# Altium schematic sheet MINI_ESC_V1.0.SchDoc: MINI有刷电调-G0
size A4; DocumentNumber: 01; Revision: V1.0; SheetNumber: 1; SheetTotal: 1
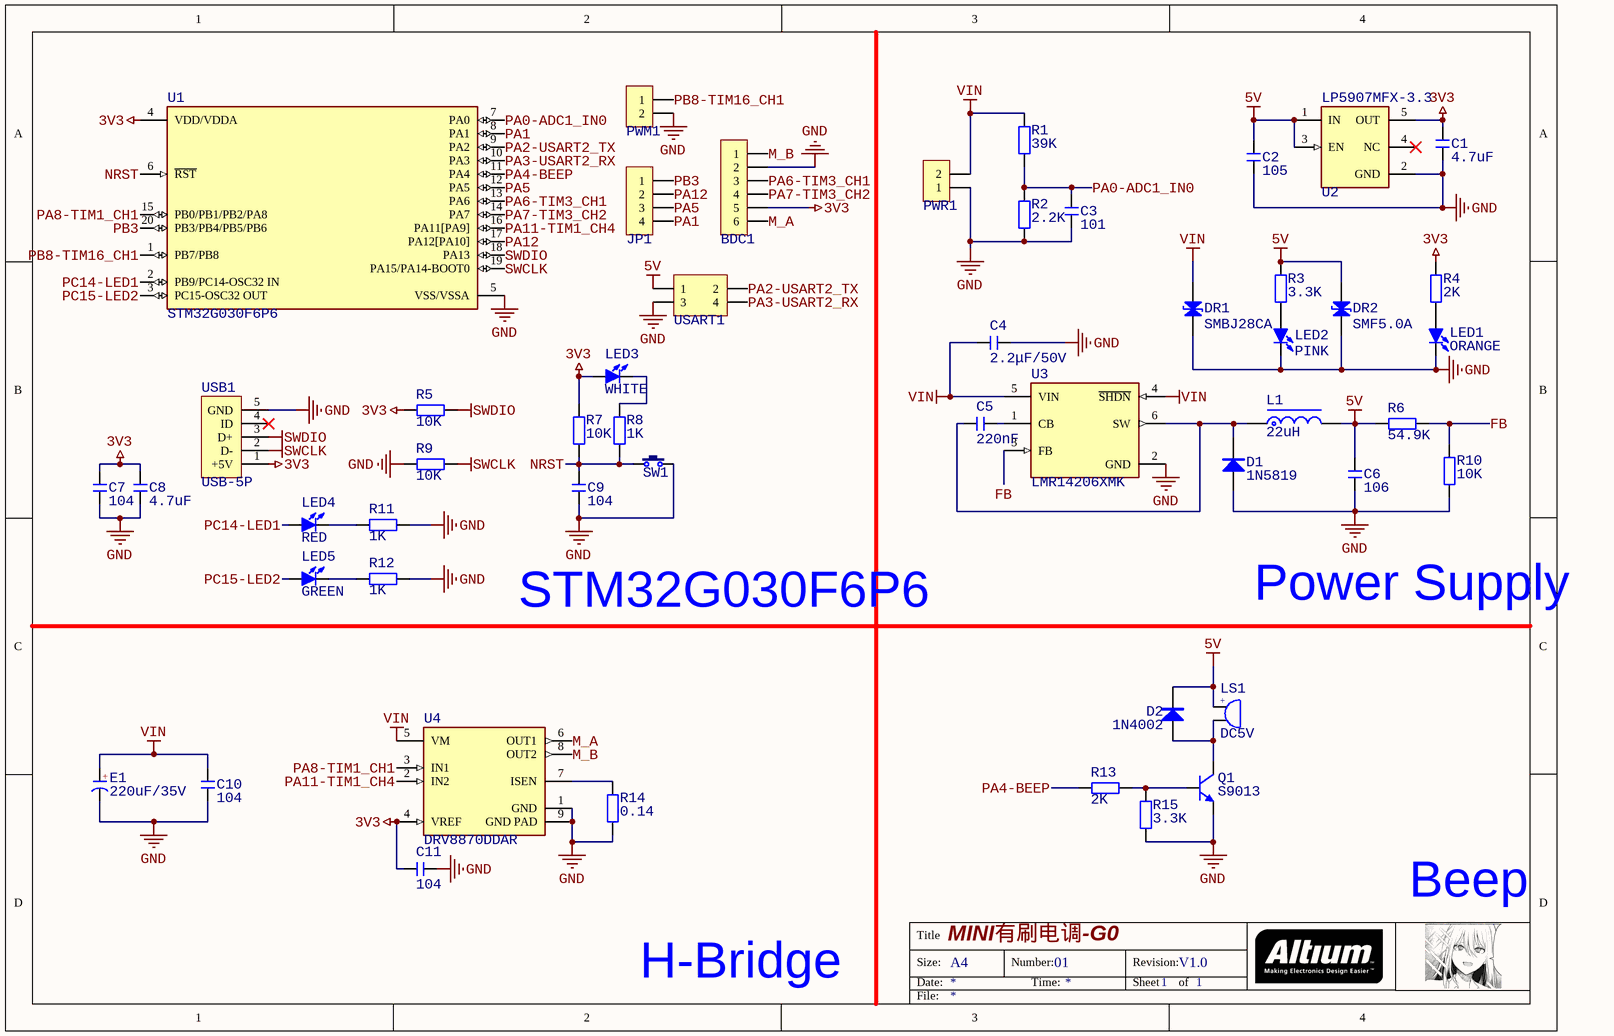
[diagram p0: MINI_ESC_V1.0.SchDoc]

## Parts
BDC1  HDR-1X6  [XH2.54-LS-6P]  (value not drawn)
C1  4.7uF  [C 0603_L]
C2  105  [C 0603_L]
C3  101  [C 0603_L]
C4  2.2μF/50V  [C 0603_L]
C5  220nF  [C 0603_L]
C6  106  [C 0603_L]
C7  104  [C 0402_L]
C8  4.7uF  [C 0402_L]
C9  104  [C 0603_L]
C10  104  [C 0402_L]
C11  104  [C 0402_L]
D1  1N5819  [SOD-123]
D2  1N4002  [SOD-123]
DR1  SMBJ28CA  [SMB]
DR2  SMF5.0A  [SOD-323]
E1  220uF/35V  [CAP 3.5*8*11.5-H - BK]
JP1  HDR-1X4  [HDR2.54-LI-4P]  (value not drawn)
L1  22uH  [NR4030]
LED1  ORANGE  [LED 0603R]
LED2  PINK  [LED 0603R]
LED3  WHITE  [LED 0603W]
LED4  RED  [LED 0603R]
LED5  GREEN  [LED 0603G]
LS1  DC5V  [BEEP 6.5x12x6]
PWM1  HDR-1X2  [GH1.25-LS-2P]  (value not drawn)
PWR1  绿头卧式2P  [15EDGVM-02P-3.81mm]  (value not drawn)
Q1  S9013  [SOT23-3L]
R1  39K  [R 0603_L]
R2  2.2K  [R 0603_L]
R3  3.3K  [R 0603_L]
R4  2K  [R 0603_L]
R5  10K  [R 0603_L]
R6  54.9K  [R 0603_L]
R7  10K  [R 0603_L]
R8  1K  [R 0603_L]
R9  10K  [R 0603_L]
R10  10K  [R 0603_L]
R11  1K  [R 0402_L]
R12  1K  [R 0402_L]
R13  2K  [R 0603_L]
R14  0.14  [R 1206_L]
R15  3.3K  [R 0603_L]
SW1  6x6x5  [TS 2PIN 6x6x4.8]  (value not drawn)
U1  STM32G030F6P6  [STMicroelectronics_TSSOP20-YA_IPC_C]
U2  LP5907MFX-3.3  [Diodes_SOT25_MFG]
U3  LMR14206XMK  [Texas_Instruments_DDC0006A_0]
U4  DRV8870DDAR  [Texas_Instruments_DDA0008J_IPC_C]
USART1  Header2X2  [HDR2.54-M-LS-2x2P]  (value not drawn)
USB1  USB-5P  [USB-MICRO_E]

## Nets
3V3: BDC1.5 C1.2 C7.2 C8.2 C11.2 LED3.1(A) R4.2 R5.2 R7.2 U1.4(VDD/VDDA) U2.5(OUT) U4.4(VREF) USB1.1(+5V)
5V: C2.2 C6.1 D2.2(K) DR2.2(K) L1.2 LS1.1 R3.2 R6.1 U2.1(IN) U2.3(EN) USART1.1
GND: BDC1.2 C1.1 C2.1 C3.1 C4.2 C6.2 C7.1 C8.1 C9.1 C10.1 C11.1 D1.1(A) DR1.2(K) DR2.1(A) E1.2(K) LED1.2(K) LED2.2(K) PWM1.2 PWR1.1 Q1.2(E) R2.1 R9.2 R10.2 R11.1 R12.1 R14.1 R15.1 SW1.2 U1.5(VSS/VSSA) U2.2(GND) U3.2(GND) U4.1(GND) U4.9(GND_PAD) USART1.3 USB1.5(GND)
SWCLK: R9.1 U1.19(PA15/PA14-BOOT0) USB1.2(D-)
SWDIO: R5.1 U1.18(PA13) USB1.3(D+)
VIN: C4.1 C10.2 DR1.1(A) E1.1(A) PWR1.2 R1.2 U3.4(~{SHDN}) U3.5(VIN) U4.5(VM)
FB: R6.2 R10.1 U3.3(FB)
M_A: BDC1.6 U4.6(OUT1)
M_B: BDC1.1 U4.8(OUT2)
NRST: C9.2 R7.1 R8.1 SW1.1 U1.6(~{RST})
PA0-ADC1_IN0: C3.2 R1.1 R2.2 U1.7(PA0)
PA1: JP1.4 U1.8(PA1)
PA2-USART2_TX: U1.9(PA2) USART1.2
PA3-USART2_RX: U1.10(PA3) USART1.4
PA4-BEEP: R13.1 U1.11(PA4)
PA5: JP1.3 U1.12(PA5)
PA6-TIM3_CH1: BDC1.3 U1.13(PA6)
PA7-TIM3_CH2: BDC1.4 U1.14(PA7)
PA8-TIM1_CH1: U1.15(PB0/PB1/PB2/PA8) U4.3(IN1)
PA11-TIM1_CH4: U1.16(PA11[PA9]) U4.2(IN2)
PA12: JP1.2 U1.17(PA12[PA10])
PB3: JP1.1 U1.20(PB3/PB4/PB5/PB6)
PB8-TIM16_CH1: PWM1.1 U1.1(PB7/PB8)
PC14-LED1: LED4.1(A) U1.2(PB9/PC14-OSC32_IN)
PC15-LED2: LED5.1(A) U1.3(PC15-OSC32_OUT)
NetC5_1: C5.1 U3.1(CB)
NetC5_2: C5.2 D1.2(K) L1.1 U3.6(SW)
NetD2_1: D2.1(A) LS1.2 Q1.3(C)
NetLED1_1: LED1.1(A) R4.1
NetLED2_1: LED2.1(A) R3.1
NetLED3_2: LED3.2(K) R8.2
NetLED4_2: LED4.2(K) R11.2
NetLED5_2: LED5.2(K) R12.2
NetQ1_1: Q1.1(B) R13.2 R15.2
NetR14_2: R14.2 U4.7(ISEN)

Not connected (* = marked no-connect by the designer): U2 4(NC)*; USB1 4(ID)*

## Notes on the sheet
- STM32G030F6P6
- Power Supply
- Beep
- H-Bridge
- Title
- Size:
- Date:
- A4
- Number:
- Time:
- Revision:
- Sheet
- of
- File:
- (in symbol BEEP) +
- (in symbol C-CAP) +

## Library data of the parts
BDC1 = Header 6: 6P接插件; BOM名称: 6P接插件
C1-C11 = C: 无极性贴片电容; 材质: X7R; BOM名称: 无极性贴片电容
D1 = 1N5819: 肖特基二极管; 属性: 40V/2A; BOM名称: 肖特基二极管
D2 = 1N4007: 整流二极管; BOM名称: 整流二极管
DR1 DR2 = DR: 瞬态电压抑制二极管; BOM名称: 瞬态电压抑制二极管
E1 = C-CAP: 直插电解电容; BOM名称: 直插电解电容
JP1 = Header 4: 4P接插件; BOM名称: 4P接插件
L1 = L-NR: NR磁胶电感; BOM名称: NR磁胶电感
LED1-LED5 = LED-SMD: 贴片LED; BOM名称: 贴片LED
LS1 = BEEP: 蜂鸣器; BOM名称: 蜂鸣器
PWM1 = Header 2: 2P接插件; BOM名称: 2P接插件
PWR1 = 绿头卧式2P: 3.81间距
Q1 = 9013-SMD: 低频放大-NPN型; 属性: 50V?0.5A?0.625W; BOM名称: 低频放大-NPN型
R1-R15 = R: 贴片电阻; BOM名称: 贴片电阻
SW1 = TSW SMD-2Pin-6x6: 2脚贴片6x6无声硅胶轻触开关; BOM名称: 2脚轻触开关
U1 = STM32G030F6P6: Arm® Cortex®-M0+ 32-bit MCU, up to 64 KB Flash, 8 KB RAM, / 2x USART, timers, ADC, comm. I/Fs, 2.0-3.6V
U2 = LP5907MFX-3.3-NOPB: 250-mA ultra-low-noise low-IQ low-dropout (LDO) linear regulator 5-SOT-23 -40 to 125
U3 = LMR14206XMK: 4.5V to 42V, 0.6A Step-Down DC/DC Switching Regulator in SOT-23 Package 6-SOT-23-THIN -40 to 125
U4 = DRV8870DDAR: 50-V, 3.6-A H-bridge motor driver with current regulation 8-SO PowerPAD -40 to 125
USART1 = Header 2X2: 2*2P接插件; BOM名称: 2*2P接插件
USB1 = USB-5P: 微型USB母座; BOM名称: 微型USB母座